# Altium schematic sheet Top.SchDoc: Top
size A; Author: Alexander Curtiss; DocumentNumber: 1; SheetNumber: 1; SheetTotal: 6
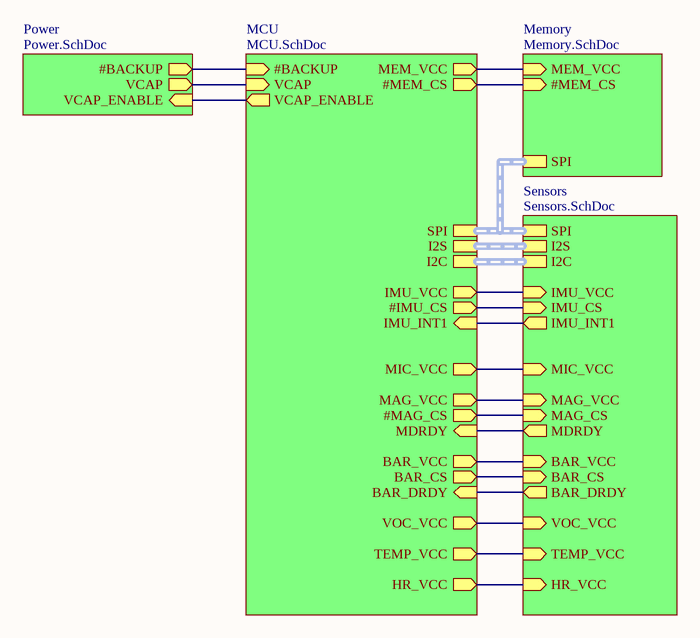
[diagram p0: Top.SchDoc]

## Sub-sheets
MCU = MCU.SchDoc: #MEM_CS (out), MEM_VCC (out), I2S (harness MCU_I2S), IMU_VCC (out), #IMU_CS (out), IMU_INT1 (in), MIC_VCC (out), MAG_VCC (out), #MAG_CS (out), BAR_VCC (out), BAR_CS (out), BAR_DRDY (in), I2C (harness MCU_I2C), VOC_VCC (out), TEMP_VCC (out), #BACKUP (in), SPI (harness MCU_SPI), MDRDY (in), HR_VCC (out), VCAP (in), VCAP_ENABLE (out)
Memory = Memory.SchDoc: SPI (harness MCU_SPI), MEM_VCC (in), #MEM_CS (in)
Power = Power.SchDoc: #BACKUP (out), VCAP (out), VCAP_ENABLE (in)
Sensors = Sensors.SchDoc: IMU_CS (in), MAG_CS (in), IMU_INT1 (out), I2S (harness MCU_I2S), IMU_VCC (in), BAR_VCC (in), SPI (harness MCU_SPI), BAR_DRDY (out), MIC_VCC (in), MAG_VCC (in), BAR_CS (in), I2C (harness MCU_I2C), VOC_VCC (in), TEMP_VCC (in), MDRDY (out), HR_VCC (in)

## Nets
(unnamed): sheet MCU/#MEM_CS, sheet Memory/#MEM_CS
(unnamed): sheet MCU/MEM_VCC, sheet Memory/MEM_VCC
(unnamed): sheet MCU/IMU_VCC, sheet Sensors/IMU_VCC
(unnamed): sheet MCU/#IMU_CS, sheet Sensors/IMU_CS
(unnamed): sheet MCU/IMU_INT1, sheet Sensors/IMU_INT1
(unnamed): sheet MCU/MIC_VCC, sheet Sensors/MIC_VCC
(unnamed): sheet MCU/MAG_VCC, sheet Sensors/MAG_VCC
(unnamed): sheet MCU/#MAG_CS, sheet Sensors/MAG_CS
(unnamed): sheet MCU/BAR_VCC, sheet Sensors/BAR_VCC
(unnamed): sheet MCU/BAR_CS, sheet Sensors/BAR_CS
(unnamed): sheet MCU/BAR_DRDY, sheet Sensors/BAR_DRDY
(unnamed): sheet MCU/VOC_VCC, sheet Sensors/VOC_VCC
(unnamed): sheet MCU/TEMP_VCC, sheet Sensors/TEMP_VCC
(unnamed): sheet MCU/#BACKUP, sheet Power/#BACKUP
(unnamed): sheet MCU/MDRDY, sheet Sensors/MDRDY
(unnamed): sheet MCU/HR_VCC, sheet Sensors/HR_VCC
(unnamed): sheet MCU/VCAP, sheet Power/VCAP
(unnamed): sheet MCU/VCAP_ENABLE, sheet Power/VCAP_ENABLE

## Buses and harness runs
harness sheet MCU/I2C = sheet Sensors/I2C
harness sheet MCU/I2S = sheet Sensors/I2S
harness sheet MCU/SPI = sheet Memory/SPI = sheet Sensors/SPI

## Notes on the sheet
- Title:
- Sheet
- of
- Project:
- Author:
- Date:
- Variant:
- Ka Moamoa
- Northwestern University
- http://kamoamoa.eecs.northwestern.edu/
- E-Mail: